# Altium schematic sheet Pyro_Sensor.SchDoc
size Letter; SheetNumber: 1; SheetTotal: 1
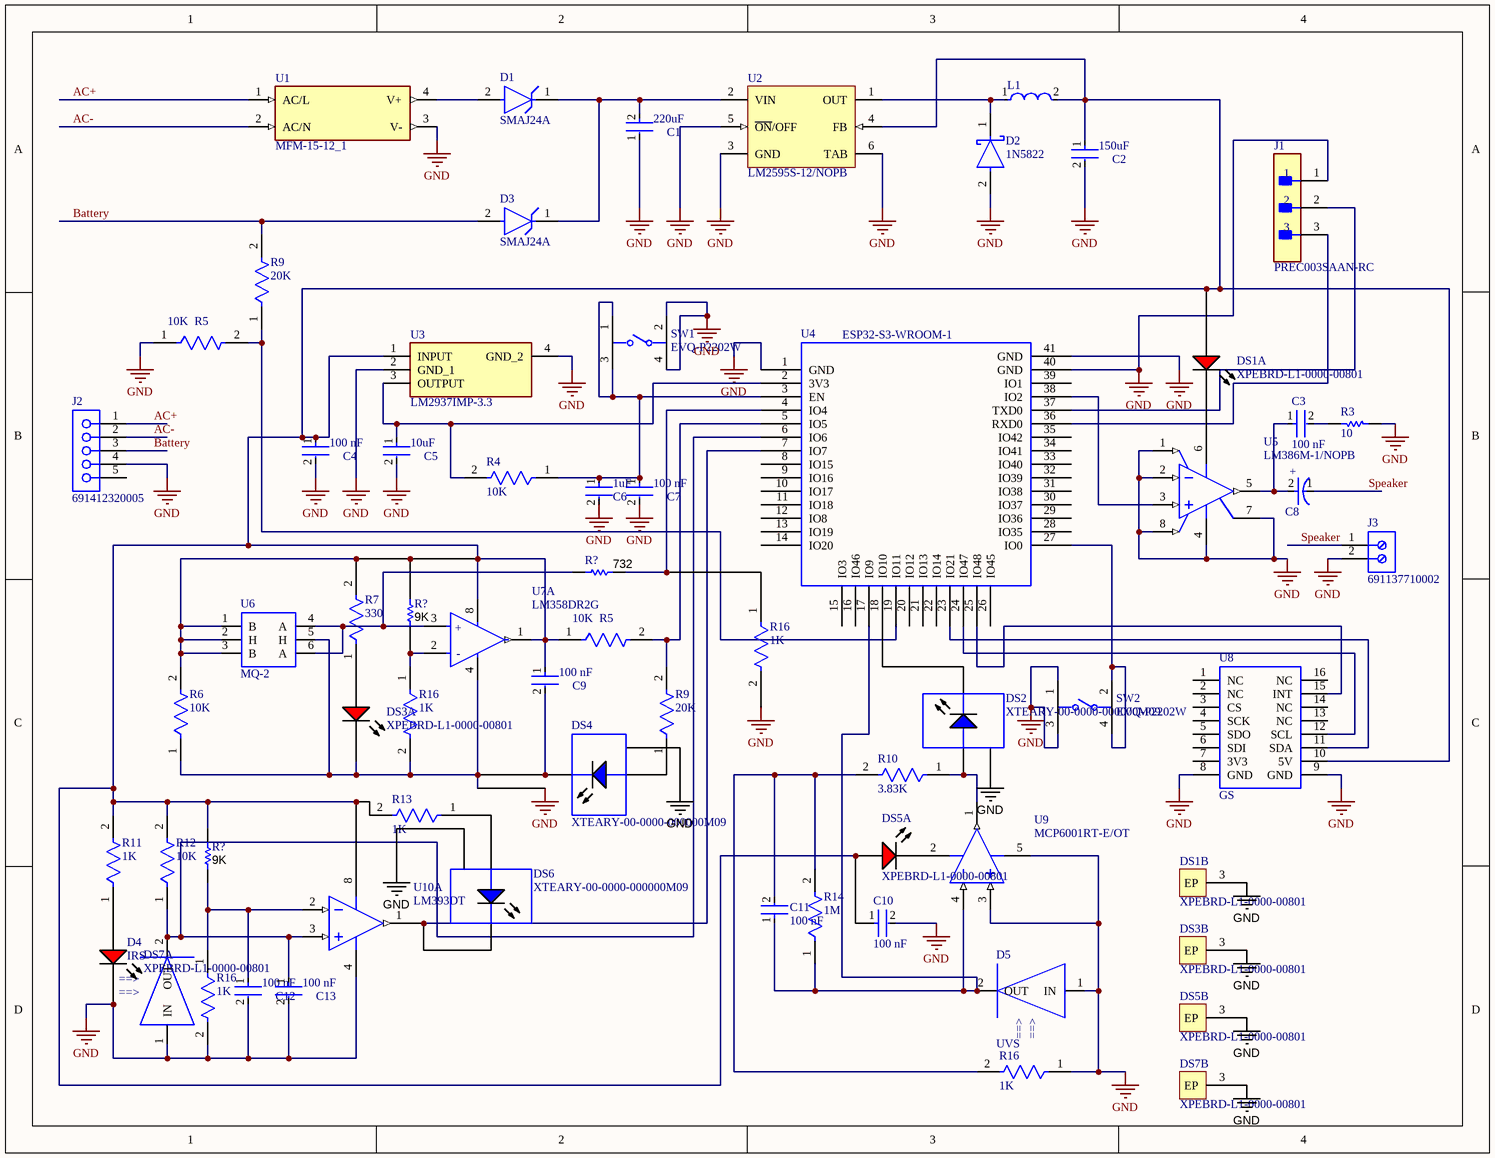
[diagram p0: Pyro_Sensor.SchDoc]

## Parts
(Parts that share a designator on the sheet are numbered #1, #2 ... from top to bottom, then left to right.)
C1  Capacitance: 220uF  [FP-GRM31C-0_3-e0_3_0_9-IPC_C]  (hidden comment: GRM31CC80E227ME11K)
C2  Capacitance: 150uF  [FP-CL32-IPC_C]  (hidden comment: CL32A157MQVNNNE)
C3  Capacitance: 100 nF  [FP-CC0805-0_85-MFG]  (hidden comment: CC0805KRX7R9BB104)
C4  Capacitance: 100 nF  [FP-CC0805-0_85-MFG]  (hidden comment: CC0805KRX7R9BB104)
C5  Capacitance: 10uF  [FP-CL21-IPC_B]  (hidden comment: CL21A106KOQNNNE)
C6  Capacitance: 1uF  [FP-R82DC4100DQ60J-MFG]  (hidden comment: R82DC4100DQ60J)
C7  Capacitance: 100 nF  [FP-CC0805-0_85-MFG]  (hidden comment: CC0805KRX7R9BB104)
C8  16SVT1000M  [FP-OS-CON-SMT-F12-MFG]  (value not drawn)
C9  Capacitance: 100 nF  [FP-CC0805-0_85-MFG]  (hidden comment: CC0805KRX7R9BB104)
C10  Capacitance: 100 nF  [FP-CC0805-0_85-MFG]  (hidden comment: CC0805KRX7R9BB104)
C11  Capacitance: 100 nF  [FP-CC0805-0_85-MFG]  (hidden comment: CC0805KRX7R9BB104)
C12  Capacitance: 100 nF  [FP-CC0805-0_85-MFG]  (hidden comment: CC0805KRX7R9BB104)
C13  Capacitance: 100 nF  [FP-CC0805-0_85-MFG]  (hidden comment: CC0805KRX7R9BB104)
D1  SMAJ24A  [FP-SMAJ-MFG]
D2  1N5822  [FP-DO-201AD-MFG]
D3  SMAJ24A  [FP-SMAJ-MFG]
D4  IRS  [IRS Thruhole]
D5  UVS  [UVS SMD]
DS1  XPEBRD-L1-0000-00801  [CREE-XPEBRD-L1_V]  (parts A,B of 2)
DS2  XTEARY-00-0000-000000M09  [CREE-XTE-2_V]
DS3  XPEBRD-L1-0000-00801  [CREE-XPEBRD-L1_V]  (parts A,B of 2)
DS4  XTEARY-00-0000-000000M09  [CREE-XTE-2_V]
DS5  XPEBRD-L1-0000-00801  [CREE-XPEBRD-L1_V]  (parts A,B of 2)
DS6  XTEARY-00-0000-000000M09  [CREE-XTE-2_V]
DS7  XPEBRD-L1-0000-00801  [CREE-XPEBRD-L1_V]  (parts A,B of 2)
J1  PREC003SAAN-RC  [FP-PREC003SAAN-RC-MFG]
J2  691412320005  [691412320005]
J3  691137710002  [691137710002]
L1  NR8040T680M  [FP-NR8040-H_4_0-MFG]  (value not drawn)
R3  Resistance: 10  [RESC2013X60X35ML10T20]  (hidden comment: RC0805FR-0710RL)
R4  Resistance: 10K  [FP-RMCF0805-MFG]  (hidden comment: RMCF0805FT10K0)
R5#1  Resistance: 10K  [FP-RMCF0805-MFG]  (hidden comment: RMCF0805FT10K0)
R5#2  Resistance: 10K  [FP-RMCF0805-MFG]  (hidden comment: RMCF0805FT10K0)
R6  Resistance: 10K  [FP-RMCF0805-MFG]  (hidden comment: RMCF0805FT10K0)
R7  Resistance: 330  [FP-CR0805-IPC_B]  (hidden comment: CR0805-JW-331ELF)
R9#1  Resistance: 20K  [FP-ERA6A-MFG]  (hidden comment: ERA6AEB203V)
R9#2  Resistance: 20K  [FP-ERA6A-MFG]  (hidden comment: ERA6AEB203V)
R10  Resistance: 3.83K  [FP-CRCW0805-e3-IPC_B]  (hidden comment: CRCW08053K83FKEA)
R11  Resistance: 1K  [FP-RR1220-IPC_A]  (hidden comment: RR1220P-102-D)
R12  Resistance: 10K  [FP-RMCF0805-MFG]  (hidden comment: RMCF0805FT10K0)
R13  Resistance: 1K  [FP-RR1220-IPC_A]  (hidden comment: RR1220P-102-D)
R14  Resistance: 1M  [FP-RG2012-MFG]  (hidden comment: RG2012P-105-B-T5)
R16#1  Resistance: 1K  [FP-RR1220-IPC_A]  (hidden comment: RR1220P-102-D)
R16#2  Resistance: 1K  [FP-RR1220-IPC_A]  (hidden comment: RR1220P-102-D)
R16#3  Resistance: 1K  [FP-RR1220-IPC_A]  (hidden comment: RR1220P-102-D)
R16#4  Resistance: 1K  [FP-RR1220-IPC_A]  (hidden comment: RR1220P-102-D)
R?#1  Resistance: 732  [RESC2013X60X35LL10T20]  (hidden comment: RC0805FR-07732RL)
R?#2  Resistance: 9K  [RESC2013X60X35ML10T20]  (hidden comment: RC0805FR-079K09L)
R?#3  Resistance: 9K  [RESC2013X60X35ML10T20]  (hidden comment: RC0805FR-079K09L)
SW1  EVQ-P2202W  [FP-EVQ-P2202W-MFG]
SW2  EVQ-P2202W  [FP-EVQ-P2202W-MFG]
U1  MFM-15-12_1  [CONV_MFM-15-12]
U2  LM2595S-12/NOPB  [KTT0005B_M]
U3  LM2937IMP-3.3  [SOT230P700X180-4N]
U4  ESP32-S3-WROOM-1  [ESP32]
U5  LM386M-1/NOPB  [TI-D8_M]
U6  MQ-2  [MQ-2 Thruhole]
U7  LM358DR2G  [FP-751-07-IPC_C]  (part A of 2)
U8  GS  [GS DIP Socket]
U9  MCP6001RT-E/OT  [SOT-23-OT5_N]
U10  LM393DT  [STM-SO-8_D_L]  (part A of 2)

## Nets
GND: C1.1 C2.2 C4.2 C5.2 C6.2 C7.2 C9.2 C10.2 C12.2 C13.2 D2.2(A) D4.1(IN) D5.1(IN) DS1.3(EP) DS2.2(EP) DS3.2(K) DS3.3(EP) DS4.2(EP) DS4.3(K) DS5.3(EP) DS6.2(EP) DS7.2(K) DS7.3(EP) J1.1 J2.4 J3.2 R3.1 R5#1.1 R6.1 R16#1.2 R16#2.2 R16#3.2 R16#4.1 SW1.2 SW1.4 SW2.1 SW2.3 U1.3(V-) U2.3(GND) U2.5(~{ON}/OFF) U2.6(TAB) U3.2(GND_1) U3.4(GND_2) U4.1(GND) U4.40(GND) U4.41(GND) U5.1(GAIN) U5.2(IN-) U5.4(GND) U5.7(BYPASS) U5.8(GAIN) U6.5(H) U7.4(VEE/GND) U8.8(GND) U8.9(GND) U9.3(VIN+) U9.5(VSS) U10.4(VCC-)
AC+: J2.1 U1.1(AC/L)
AC-: J2.2 U1.2(AC/N)
Battery: D3.2(A) J2.3 R9#1.2
Speaker: C8.1(C) J3.1
NetC1_2: C1.2 D1.1(C) D3.1(C) U2.2(VIN)
NetC2_1: C2.1 C4.1 C9.1 C10.1 DS1.1(A) DS5.1(A) L1.2 R5#2.1 R6.2 R7.2 R11.2 R12.2 R13.2 R?#2.2 R?#3.2 U2.4(FB) U3.1(INPUT) U6.1(B) U6.2(H) U6.3(B) U7.1(OUTPUT_A) U7.8(VCC) U8.10(5V) U10.8(VCC+)
NetC3_1: C3.1 C8.2(A) U5.5(VOUT)
NetC3_2: C3.2 R3.2
NetC5_1: C5.1 R4.2 U3.3(OUTPUT) U4.2(3V3)
NetC6_1: C6.1 C7.1 R4.1 SW1.1 SW1.3 U4.3(EN)
NetC11_1: C11.1 D5.2(OUT) R14.1 U4.17(IO9) U9.4(VIN-)
NetC11_2: C11.2 R10.2 R14.2 R16#4.2
NetC12_1: C12.1 R16#3.1 R?#3.1 U10.2(IN1-)
NetC13_1: C13.1 D4.2(OUT) R12.1 U4.6(IO6) U10.3(IN1+)
NetD1_2: D1.2(A) U1.4(V+)
NetD2_1: D2.1(C) L1.1 U2.1(OUT)
NetDS1_2: DS1.2(K) U5.6(VS)
NetDS2_1: DS2.1(A) R10.1 U9.1(VOUT)
NetDS2_3: DS2.3(K) U4.18(IO10)
NetDS3_1: DS3.1(A) R7.1
NetDS4_1: DS4.1(A) R9#2.1
NetDS5_2: DS5.2(K) U9.2(VDD)
NetDS6_1: DS6.1(A) R13.1
NetDS6_3: DS6.3(K) U4.7(IO7) U10.1(OUT1)
NetDS7_1: DS7.1(A) R11.1
NetJ1_2: J1.2 U4.37(TXD0)
NetJ1_3: J1.3 U4.36(RXD0)
NetR5#1_2: R5#1.2 R9#1.1 U4.19(IO11)
NetR5#2_2: R5#2.2 R9#2.2 U4.5(IO5)
NetR16#1_1: R16#1.1 R?#1.1 U4.4(IO4)
NetR16#2_1: R16#2.1 R?#2.1 U7.2(INPUT_A-)
NetR?#1_2: R?#1.2 U6.4(A) U6.6(A) U7.3(INPUT_A+)
NetSW2_2: SW2.2 SW2.4 U4.27(IO0)
NetU4_23: U4.23(IO21) U8.11(SDA)
NetU4_24: U4.24(IO47) U8.12(SCL)
NetU4_25: U4.25(IO48) U8.15(INT)
NetU4_38: U4.38(IO2) U5.3(IN+)

Not connected (* = marked no-connect by the designer): J2 5; U4 8(IO15) 9(IO16) 10(IO17) 11(IO18) 12(IO8) 13(IO19) 14(IO20) 15(IO3) 16(IO46) 20(IO12) 21(IO13) 22(IO14) 26(IO45) 28(IO35) 29(IO36) 30(IO37) 31(IO38) 32(IO39) 33(IO40) 34(IO41) 35(IO42) 39(IO1); U8 1(NC) 2(NC) 3(CS) 4(SCK) 5(SDO) 6(SDI) 7(3V3) 13(NC) 14(NC) 16(NC)

## Notes on the sheet
- (in symbol CMP-1310-00291-2, part A) +; -
- (in symbol CMP-05428-000645-1) +
- (in symbol GUVA-S12SD) <==
- (in symbol IR Photodiode) <==

## Library data of the parts
C1 = CMP-06035-009531-1: Chip Multilayer Ceramic Capacitors for General Purpose, 1206, 220uF, X6S, 22%, 20%, 2.5V; Dielectric: X6S; Thickness: 1.6mm; Length: 3.2mm; Voltage Rating (DC): 2.5V; Width: 1.6mm; Tolerance: 20%
C2 = CMP-2000-06109-2: Cap Ceramic 150uF 6.3V X5R ±20% SMD 1210 +85°C Embossed T/R; Width: 0.098inch; Case Code (Metric): 3225; Case/Package: 1210; Package Quantity: 1; Voltage Rating (DC): 6.3V; Mount: Surface Mount; Packaging: Tape and Reel; Max Operating Temperature: 85°C; Case Code (Imperial): 1210; Tolerance: 20%; Length: 0.126inch; Thickness: 0.11inch; Min Operating Temperature: -55°C; Voltage Rating: 6.3V; Lead Free: Lead Free
C3 C4 C7 C9-C13 = CMP-2100-03606-3: CAP CER 0.1UF 50V X7R 0805; Manufacturer: Yageo; Tolerance: 0.1; Value: 100 nF; Material: Ceramic; Device Class L1: Passive Components; ComponentLink2Description: Datasheet; Package: CC0805-0.85; Manufacturer Part Number: CC0805KRX7R9BB104; Digikey Description: CAP CER 0.1UF 50V X7R 0805; Device Class L3: Ceramic Capacitors; Temperature: -30°C to +85°C; Temperature Characteristic: X7R; Voltage Rating: 50 V; Height: 0.95mm; RoHS: TRUE; Ipc Land Pattern Name: CAPC200125X85; Device Class L2: Capacitors; Category: Cap; Temperature Range Low: -30°C; Temperature Range High: +85°C; Mouser Description: Multilayer Ceramic Capacitors MLCC - SMD/SMT 100nF 50V X7R 10%; Footprint Url: http://www.yageo.com/exep/pages/download/literatures/UPY-C_GEN_24.pdf; Automotive: No; Octopart: https://octopart.com/cc0805krx7r9bb104-yageo-192993; Lead Free: Yes; ComponentLink2URL: http://www.yageo.com/documents/recent/UPY-GPHC_Y5V_6.3V-to-50V_8.pdf
C5 = CMP-2000-06102-2: CL21 Series 0805 10uF 16V ±10% Tolerance X5R Multilayer Ceramic Chip Capacitor; Dielectric: X7R; Length: 2mm; Depth: 1.25mm; Voltage: 16V; Width: 0.049inch; Lead Free: Lead Free; Max Operating Temperature: 85°C; Mount: Surface Mount; Voltage Rating: 16V; Height: 1.25mm; Radiation Hardening: No; Packaging: Tape and Reel; Voltage Rating (DC): 16V; Thickness: 0.055inch; Case/Package: 0805; Case Code (Imperial): 0805; Min Operating Temperature: -55°C; Case Code (Metric): 2012; Package Quantity: 1; Tolerance: 10%
C6 = CMP-03022-000017-1: CAP FILM 1UF 5% 63VDC RADIAL; Voltage Rating (DC): 63V; Lead Diameter: 0.5mm; Insulation Resistance: 30R; Dielectric: PET; Voltage Rating (AC): 40V; Dissipation Factor: 80%; Life (Hours): 2000Hour; Type: General Purpose; Mount: Through Hole; Case/Package: Radial; Package Quantity: 1700; Construction: RADIAL; Lead Pitch: 5mm; Depth: 5mm; Series: R82; Packaging: Tape and Reel; RoHS Compliant: Yes; Voltage Rating: 63V; Height - Seated (Max): 0.398inch; Voltage: 63V; Radiation Hardening: No; Width: 5mm; REACH SVHC: No SVHC; Min Operating Temperature: -55°C; Tolerance: 5%; Dielectric Material: PET; Contact Plating: Tin; Termination: Radial; Length: 7.2mm; Max Operating Temperature: 105°C
C8 = CMP-05428-000645-1: Conductive Polymer Aluminum Solid Capacitors (OS-CON) 1000uF ±20% 16V RADIAL SMT 10x12.6mm; RoHS Compliant: Yes
D1 D3 = CMP-08607-000085-1: TVS DIODE 24V 38.9V DO214AC; Manufacturer: Littelfuse Inc; Direction: Unidirectional; Peak Pulse Power: 400W; Peak Pulse Current: 10.3A; Max Junction Temp: +150°C; Breakdown Voltage: 26.7V; Number Of Channels: 1; ComponentLink2Description: Datasheet; Device Class L3: unset; Height: 2.29mm; ComponentLink2URL: https://www.littelfuse.com/~/media/electronics/datasheets/tvs_diodes/littelfuse_tvs_diode_smaj_datasheet.pdf.pdf; Device Class L1: Circuit Protection; Package: SMAJ; Temperature Range High: +150°C; Device Class L2: TVS Diodes; Clamping Voltage: 38.9V; Reverse Standoff Voltage: 24V; Manufacturer Part Number: SMAJ24A; Mouser Description: In a Pack of 25, Littelfuse SMAJ24A, Uni-Directional TVS Diode, 400W, 2-Pin DO-214AC; Digikey Description: TVS DIODE 24V 38.9V DO214AC; Lead Free: Yes; Octopart: https://octopart.com/smaj24a-littelfuse-350003; Automotive: No; Temperature Range Low: -65°C; Category: Diode; RoHS: TRUE; Temperature: -65°C to +150°C
D2 = CMP-12187-000025-1: DIODE SCHOTTKY 40V 3A DO201AD; Manufacturer: STMicroelectronics; Max Junction Temp: +150°C; Peak Reverse Current: 2mA; Max Surge Forward Current: 80A; Temperature Range High: +150°C; Automotive: No; RoHS: TRUE; ComponentLink2Description: Datasheet; Manufacturer Part Number: 1N5822; Lead Free: Yes; Octopart: https://octopart.com/1n5822-stmicroelectronics-323225; Device Class L2: Diodes; Max Repetitive Reverse Voltage: 40V; Temperature: to +150°C; Height: 5.3mm; Category: Diode; Digikey Description: DIODE SCHOTTKY 40V 3A DO201AD; ComponentLink2URL: https://www.st.com/resource/en/datasheet/1n5822.pdf; Device Class L3: Schottky Diodes; Device Class L1: Discrete Semiconductors; Forward Current: 3A; Mouser Description: Schottky Diodes & Rectifiers Vr/40V Io/3A BULK; Package: DO-201AD
D4 = IR Photodiode
D5 = GUVA-S12SD
DS1 DS3 DS5 DS7 = CMP-2000-07424-1: Cree(R) XLamp(R) XP-E2 LED, Red, Dominant Wavelength 620 to 630 nm, Minimum Luminous Flux 73.9 lm, 2-Pin SMD, RoHS, Tape and Reel; Manufacturer: Cree,Inc.; Forward Voltage: 2.2V; Power Rating: 3W; Wavelength: 630nm; Viewing Angle: 130deg; Lens Color/Style: Clear; Forward Current: 350mA; Luminous Flux/Radiant Flux: 73.9lm; RoHS: Details; Product Category: HighPowerLEDs-SingleColor; Mounting Style: SMD/SMT; Mounting Technology: SurfaceMount; Series: XlampXP-E2Color; Package Description: 3-Pin Surface Mount Device, Body 3.45 x 3.45 mm; Illumination Color: Red; Datasheet URL: http://www.cree.com/sitecore-modules/web/~/media/Files/Cree/LED-Components-and-Modules/XLamp/Data-and-Binning/XLampXPE2.pdf; Datasheet Version: Rev. 8I, 05/2016; Maximum Operating Temperature: +150C; Package Reference: XPEBRD-L1; Factory Pack Quantity: 1000; Packaging: Reel; Manufacturer URL: http://www.cree.com/; Brand: Cree,Inc.
DS2 DS4 DS6 = CMP-2100-02557-1: LED, Blue, 2.85 V, 2-Pin SMD, RoHS, Tape and Reel
J1 = CMP-00595-22265080-1: PREC003SAAN-RC Conn Header Vert 3POS 2.54MM; Number of Contacts: 3; Connector Type: Male Pin; Current Rating: 3A; Height: 8.74mm; Contact Mating Length: 5.842mm; Min Operating Temperature: -40°C; Termination: Solder; Packaging: Bulk; Pitch: 2.54mm; Color: Black; Mount: Through Hole; Contact Material: Nickel, Tin; Number of Rows: 1; NexarPartId: 22265080; Max Operating Temperature: 105°C; RoHS: Compliant; Contact Plating: Tin; Number of Positions: 3
J2 = CMP-1502-02954-2: NexarPartId: 78871498; Number of Pins: 5; Lead Pitch: 3.81mm; RoHS: Non-Compliant; Packaging: Box
J3 = CMP-1502-03324-2: NexarPartId: 78871135; Voltage Rating: 300V; Number of Contacts: 2; Current Rating: 16A; Lead Pitch: 5mm; Height: 11.6mm; Packaging: Box; RoHS: Non-Compliant; Contact Material: Nickel, Tin; Max Operating Temperature: 120°C; Number of Pins: 2; Min Operating Temperature: -30°C; Number of Rows: 1
L1 = CMP-14484-001165-1: Shielded Wirewound Inductor 68uH 20% 1.1A 0.299Ω SMD; Test Frequency: 100kHz; DC Resistance (DCR): 299mR; Max DC Current: 1.2A; Self Resonant Frequency: 7MHz; Core Material: Ferrite; Resistor Type: Wirewound; Tolerance: 20%; Series: NR; Case/Package: Nonstandard; Max Operating Temperature: 120°C; Height: 4mm; Inductance: 68uH; RoHS Compliant: Yes; Halogen Free: Halogen Free; Radiation Hardening: No; Min Operating Temperature: -25°C; Number of Pins: 2; Shielding: Shielded; Package Quantity: 1; Height - Seated (Max): 0.157inch; Packaging: Tape and Reel; Saturation Current: 1.2A; Depth: 8.2mm; Termination: SMD/SMT; Current Rating: 1.1A; Length: 0.315inch; Width: 8mm; Mount: Surface Mount
R3 = CMP-2100-03670-1: Chip Resistor, 10 Ohm, +/- 1%, 0.125 W, -55 to 155 degC, 0805 (2012 Metric), RoHS, Tape and Reel; Manufacturer: Yageo; Power Rating: 125mW; Voltage Rating: 150V; Temperature Coefficient: 200ppm/degreesC; Number of Pins: 2; REACH SVHC: NoSVHC; Datasheet Version: Rev. 5, 10/2016; Max Operating Temperature: 155degC; Manufacturer URL: http://www.yageo.com/; Case Code (Imperial): 0805; Package Description: 2-Pin Surface Mounted Device, Body 2 x 1.25 mm; Case Code (Metric): 2012; Length: 2mm; RoHSCompliant: true; Max Power Dissipation: 125mW; Depth: 1.25mm; Packaging: TapeandReel; Height: 0.5mm; Package Reference: 0805; Package Quantity: 1; Tolerance: 1%; Termination: SMD/SMT; Min Operating Temperature: -55degC; Lead Free: LeadFree; Width: 1.25mm; Voltage Rating (DC): 150V; Datasheet URL: http://www.yageo.com/NewPortal/yageodocoutput?fileName=/pdf/R-Chip/PYu-RC_Group_51_RoHS_L_5.pdf; Composition: ThickFilm; Number of Terminations: 2; Case/Package: 0805
R4 R5#1 R5#2 R6 R12 = CMP-26527-000121-1: RES 10K OHM 1% 1/8W 0805; Power Rating: 125mW; Temperature Coefficient: 100ppm/°C; Depth: 1.25mm; Construction: Rectangular; Packaging: Tape and Reel; Tolerance: 1%; Lead Free: Lead Free; Case/Package: 0805; RoHS Compliant: Yes; Series: RMCF; Width: 0.049inch; Max Power Dissipation: 125mW; Contact Plating: Tin; Height: 0.026inch; Mount: Surface Mount; Resistor Type: Thick Film; Size Code: 0805; Length: 2mm; Max Operating Temperature: 155°C; Features: Automotive AEC-Q200; Radiation Hardening: No; Case Code (Imperial): 0805; Min Operating Temperature: -55°C; Case Code (Metric): 2012; Number of Terminations: 2; Military Standard: Not
R7 = CMP-07231-005909-1: Thick Film Chip Resistors 0805 330Ω 0.125W 5% 200ppm/°C; Voltage Rating (DC): 150V; Max Power Dissipation: 125mW; Min Operating Temperature: -55°C; Number of Terminations: 2; Width: 0.049inch; Number of Pins: 2; REACH SVHC: No SVHC; Contact Plating: Tin; Max Operating Temperature: 155°C; Mount: Surface Mount; Case Code (Metric): 2012; Length: 2mm; Package Quantity: 1; Tolerance: 5%; Composition: Thick Film; Packaging: Tape and Reel; Case Code (Imperial): 0805; Radiation Hardening: No; Height: 0.024inch; Thickness: 508um; Case/Package: 0805; Termination: SMD/SMT; Voltage Rating: 150V; Power Rating: 125mW; Depth: 1.25mm; Temperature Coefficient: 200ppm/°C; Features: Moisture Resistant; Military Standard: Not
R9#1 R9#2 = CMP-2001-00610-2: RES 20K OHM 0.1% 1/8W 0805; Power Rating: 125mW; Voltage Rating (DC): 100V; Temperature Coefficient: 25ppm/°C; REACH SVHC: No SVHC; Features: Automotive AEC-Q200; Tolerance: 0.1%; Size Code: 0805; Max Power Dissipation: 125mW; Termination: SMD/SMT; Package Quantity: 1; Resistor Type: Thin Film; Number of Pins: 2; Width: 1.25mm; Technology: THIN FILM; Min Operating Temperature: -55°C; Length: 2mm; Mount: Surface Mount; Height: 0.5mm; Resistance Tolerance: 0.1%; Military Standard: Not; Case Code (Imperial): 0805; Contact Plating: Tin; Case Code (Metric): 2012; Number of Terminations: 2; RoHS Compliant: Yes; Voltage Rating: 100V; Lead Free: Lead Free; Depth: 1.25mm; Construction: Rectangular; Case/Package: 0805; Radiation Hardening: No; Series: ERA-6A; Max Operating Temperature: 155°C; Packaging: Tape and Reel
R10 = CMP-2001-03885-2: RES Thick Film, 3.83kΩ, 1%, 0.125W, 100ppm/°C, 0805; Working Voltage: 150V; Power Rating: 125mW; Features: Automotive AEC-Q200; Width: 1.25mm; Lead Free: Lead Free; Voltage Rating: 150V; Package Quantity: 5000; Depth: 1.25mm; Weight: 0.000194oz; Number of Terminations: 2; Temperature Coefficient: 100ppm/°C; Radiation Hardening: No; Packaging: Tape and Reel; Max Power Dissipation: 125mW; Height: 0.45mm; Case Code (Metric): 2012; Min Operating Temperature: -55°C; Voltage Rating (DC): 150V; Max Operating Temperature: 155°C; Case/Package: 0805; Contact Plating: Tin; Length: 2mm; Tolerance: 1%; Number of Pins: 2; Case Code (Imperial): 0805; Composition: Thick Film; Military Standard: Not; Termination: SMD/SMT
R11 R13 R16#1-R16#4 = CMP-2001-03210-2: 1kΩ ±0.5% 0.1W 1/10W Chip Resistor 0805 (2012 Metric) Thin Film; Voltage Rating (DC): 100V; Temperature Coefficient: 25ppm/°C; Power Rating: 100mW; Packaging: Tape and Reel; Max Operating Temperature: 125°C; Resistor Type: Thin Film; Length: 2mm; Number of Terminations: 2; Resistance Tolerance: 0.5%; Termination: SMD/SMT; Height: 0.4mm; Max Power Dissipation: 100mW; Lead Free: Lead Free; Min Operating Temperature: -55°C; Size Code: 0805; Voltage Rating: 100V; Package Quantity: 1; Width: 1.25mm; Depth: 1.25mm; Case/Package: 0805; Case Code (Imperial): 0805; Case Code (Metric): 2012; Tolerance: 0.5%; Series: RR; RoHS Compliant: Yes; Technology: THIN FILM
R14 = CMP-2001-02713-2: Automotive Metal Thin Film Chip Resistor, 0805, 1MΩ, 0.1%, 25ppm/°C, 0.125W, 150V; Max Power Dissipation: 125mW; Power Rating: 100mW; Voltage Rating: 100V; Voltage Rating (DC): 150V; Lead Free: Lead Free; Length: 2mm; Number of Terminations: 2; RoHS Compliant: Yes; Case/Package: 0805; Height: 0.4mm; Case Code (Metric): 2012; Temperature Coefficient: 25ppm/°C; Features: Automotive AEC-Q200; Package Quantity: 5000; Width: 1.25mm; Termination: SMD/SMT; Case Code (Imperial): 0805; Tolerance: 0.1%; Max Operating Temperature: 155°C; Packaging: Tape and Reel; Min Operating Temperature: -55°C; Series: RG
R?#1 = CMP-2001-01260-1: Manufacturer: Yageo; Part Number: RC0805FR-07732RL
R?#2 R?#3 = CMP-2001-01318-2: Chip Resistor, 9.09 KOhm, +/- 1%, 0.125 W, -55 to 155 degC, 0805 (2012 Metric), RoHS, Tape and Reel; Case\Package: 0805; Voltage Rating: 150 V; Power Rating: 125 mW; Width: 1.25 mm; Height: 0.5 mm; Packaging: Tape and Reel; Case Code (Imperial): 0805; RoHSCompliant: true; ComponentLink1URL: http://www.yageo.com/; ComponentLink2Description: Datasheet; Case Code (Metric): 2012; Max Operating Temperature: 155 degC; PackageReference: 0805; DatasheetVersion: Rev. 4, 02/2016; ComponentLink2URL: http://www.yageo.com/documents/recent/PYu-RC_Group_51_RoHS_L_04.pdf; Length: 2 mm; Package Quantity: 5000; Min Operating Temperature: -55 degC; Mounting Technology: Surface Mount; ComponentLink1Description: Manufacturer URL; PackageDescription: 2-Pin Surface Mounted Device, Body 2 x 1.25 mm; Tolerance: 1%
SW1 SW2 = CMP-05618-000132-1: SWITCH TACTILE SPST-NO 0.02A 15V; Current Rating: 20mA; Operating Force: 1.6N; Electrical Life: 1000000Cycles; Actuator Color: Natural; Switch Function: Off-Mom; Contact Resistance: 100mR; Throw Configuration: SPST; Illumination Type: Non-Illuminated; Actuator Length: 0.85mm; Switch Travel: 0.25mm; Series: EVQP2; Termination: J-Bend; Lead Free: Lead Free; Package Quantity: 1; REACH SVHC: No SVHC; Mechanical Life: 1000000Cycles; Height: 2.5mm; Length: 3.5mm; Radiation Hardening: No; Color: Natural; Contact Plating: Gold; Packaging: Tape and Reel; Voltage Rating (DC): 15V; Depth: 5.5mm; RoHS Compliant: Yes; Max Operating Temperature: 85°C; Min Operating Temperature: -40°C; Max Voltage Rating (DC): 15V; Contact Current Rating: 20mA; Size: 3.5mm; Orientation: Straight; Max Current Rating: 20mA; Mount: Surface Mount
U1 = MFM-15-12_1: Open Frame AC DC Converters 1 Uitgang 12V - - - 1.25A 80 ~ 264 VAC Input; MF: MEAN WELL; Package: DIP-4 Mean-Well USA, Inc.; Price: None; Check_prices: https://www.snapeda.com/parts/MFM-15-12/MEAN+WELL+USA+Inc./view-part/?ref=eda; Value: *; SnapEDA_Link: https://www.snapeda.com/parts/MFM-15-12/MEAN+WELL+USA+Inc./view-part/?ref=snap; MP: MFM-15-12; Availability: In Stock; Purchase-URL: https://pricing.snapeda.com/search?q=MFM-15-12&ref=eda
U2 = CMP-0069-00217-3: SIMPLE SWITCHER® Power Converter 150 KHz 1A Step-Down Voltage Regulator, 5-pin TO-263, Pb-Free; Manufacturer: Texas Instruments; PowerWise: N; PackageTopMarking: NSUZXYTTE#*LM2595S*-12 P+; ComponentLink1Description: Datasheet URL; ComponentLink1URL: http://www.ti.com/general/docs/lit/getliterature.tsp?genericPartNumber=LM2595&fileType=pdf; PackageReference: KTT0005B; RoHS: Y; PinCount: 5; Code_JEDEC: MO-169-AB; CompType: Switcher; PackageDescription: TO-263, Molded, .400 x .390 x .180in, 5 Lead, .067in Pitch, Surface Mount
U3 = LM2937IMP-3.3: Integrated Circuit; Manufacturer_Name: Texas Instruments; Datasheet Link: https://www.ti.com/lit/gpn/LM2937; Height: 1.8mm; Manufacturer_Part_Number: LM2937IMP-3.3; Mouser Part Number: 926-LM2937IMP-33; Mouser Price/Stock: https://www.mouser.co.uk/ProductDetail/Texas-Instruments/LM2937IMP-3.3?qs=X1J7HmVL2ZHQ6GEvMvFiRA%3D%3D; Arrow Part Number: LM2937IMP-3.3; Arrow Price/Stock: https://www.arrow.com/en/products/lm2937imp-3.3/texas-instruments?region=nac
U4 = ESP32
U5 = CMP-0994-00001-1: Low Voltage Audio Power Amplifier, 0 to 70 degC, 8-pin SOIC (D8), Green (RoHS & no Sb/Br); Manufacturer: Texas Instruments; Input Type: Analog; SubFamily: Mid/High-Power Amplifier; Max. Number of Speaker Outputs: 1; PackageVersion: 4040047-3/M, 06/2011; ComponentLink2Description: Datasheet; DatasheetVersion: SNAS545A; ComponentLink3URL: http://www.ti.com/litv/pdf/msoi002j; ComponentLink1URL: http://www.ti.com/; Mounting Technology: Surface Mount; Eco-Plan: Green (RoHS & no Sb/Br); ComponentLink3Description: Package Specification; ComponentLink2URL: http://www.ti.com/general/docs/lit/getliterature.tsp?genericPartNumber=LM386&fileType=pdf; PartNumber: LM386M-1/NOPB; PackageDescription: 8-Pin Plastic Small Outline, Body 4.9 x 3.9 mm, Pitch 1.27 mm; ComponentLink1Description: Manufacturer URL; Code_JEDEC: MS-012; PackageReference: D8
U6 = MQ-2 Gas Sensor
U7 = CMP-1310-00291-2: IC OPAMP GP 2 CIRCUIT 8SOIC; Gain Bandwidth Product: 1MHz; Number of Circuits: 2; Min Supply Voltage: 3V; Slew Rate: 0.6V/µs; Max Dual Supply Voltage: 16V; Common Mode Rejection Ratio: 65dB; Input Bias Current: 250nA; Min Dual Supply Voltage: 1.5V; Dual Supply Voltage: 9V; Operating Supply Current: 1.5mA; Output Current: 40mA; Input Offset Voltage (Vos): 7mV; Nominal Supply Current: 1.2mA; Voltage Gain: 100dB; Max Supply Voltage: 32V; Width: 4mm; Number of Pins: 8; Min Operating Temperature: 0°C; REACH SVHC: No SVHC; Contact Plating: Tin; Lead Free: Lead Free; Halogen Free: Halogen Free; Power Supply Rejection Ratio (PSRR): 65dB; Operating Supply Voltage: 16V; Package Quantity: 2500; Max Operating Temperature: 70°C; Case/Package: SOIC; Height: 1.5mm; Packaging: Tape and Reel; Radiation Hardening: No; Number of Channels: 2; Bandwidth: 1MHz; Length: 5mm; Number of Elements: 2; Number of Amplifiers: 2; Output Current per Channel: 40mA
U8 = MIKROE-4299
U9 = CMP-0187-00464-3: None; Max Supply Voltage: 6V; Supply Current: 100uA; Input Offset Voltage (Vos): 4.5mV; Bandwidth: 1MHz; Common Mode Rejection Ratio: 60dB; Input Bias Current: 1pA; Slew Rate: 0.6V/µs; Number of Amplifiers: 1; Operating Supply Voltage: 5.5V; Power Supply Rejection Ratio (PSRR): 86dB; Amplifier Type: GENERAL PURPOSE; Voltage Gain: 112dB; Output Current: 23mA; Min Supply Voltage: 1.8V; Mount: Surface Mount; Min Operating Temperature: -40°C; Packaging: Tape and Reel; Radiation Hardening: No; Max Operating Temperature: 125°C; Case/Package: SOT-23; REACH SVHC: No SVHC; Nominal Supply Current: 100uA; Technology: CMOS; Length: 3.1mm; Gain Bandwidth Product: 1MHz; Width: 1.8mm; Number of Channels: 1; RoHS Compliant: Yes; Number of Pins: 5; Number of Elements: 1; Package Quantity: 3000; Unity Gain Bandwidth Product: 1MHz; Number of Circuits: 1; Height: 1.3mm; Lead Free: Lead Free
U10 = CMP-2000-06550-1: Low-Power, Dual-Voltage Comparator, 2 to 36 V, 0 to 70 degC, 8-Pin SOIC (SO), RoHS, Tape and Reel; Manufacturer: STMicroelectronics; Voltage - Supply, Single/Dual (±): 2V~36V,±1V~18V; Current - Input Bias (Max): 0.25µA@5V; Number of Elements: 2; Current - Output (Typ): 18mA@5V; Other Names: 497-1593-2; Voltage - Input Offset (Max): 5mV@30V; Output Type: CMOS,DTL,ECL,MOS,Open-Collector,TTL; EDA / CAD Models: DownloadfromAcceleratedDesigns; Other Related Documents: LM393ViewAllSpecificationsLM393ViewAllSpecifications; Online Catalog: Comparators-2elements; Current - Quiescent (Max): 2.5mA; Standard Package: 2,500; Manufacturer URL: http://www.st.com/; Package Description: 8-Pin Small Outline Integrated Circuit, Body 4.9 x 3.9 mm, Pitch 1.27 mm; Packaging: Tape&Reel(TR); Datasheet Version: Rev. 15, 02/2016; Category: IntegratedCircuits(ICs); Operating Temperature: 0°C~70°C; Mounting Type: SurfaceMount; Supplier Device Package: 8-SO; Datasheet URL: http://www.st.com/content/ccc/resource/technical/document/datasheet/group1/b4/cc/cf/13/18/28/44/f5/CD00000465/files/CD00000465.pdf/jcr:content/translations/en.CD00000465.pdf; Family: Linear-Comparators; Mounting Technology: SurfaceMount; Type: GeneralPurpose; Package Reference: SO-8; Package / Case: 8-SOIC(0.154",3.90mmWidth)